# EAGLE design engine_driver (EAGLE 7.2.0)
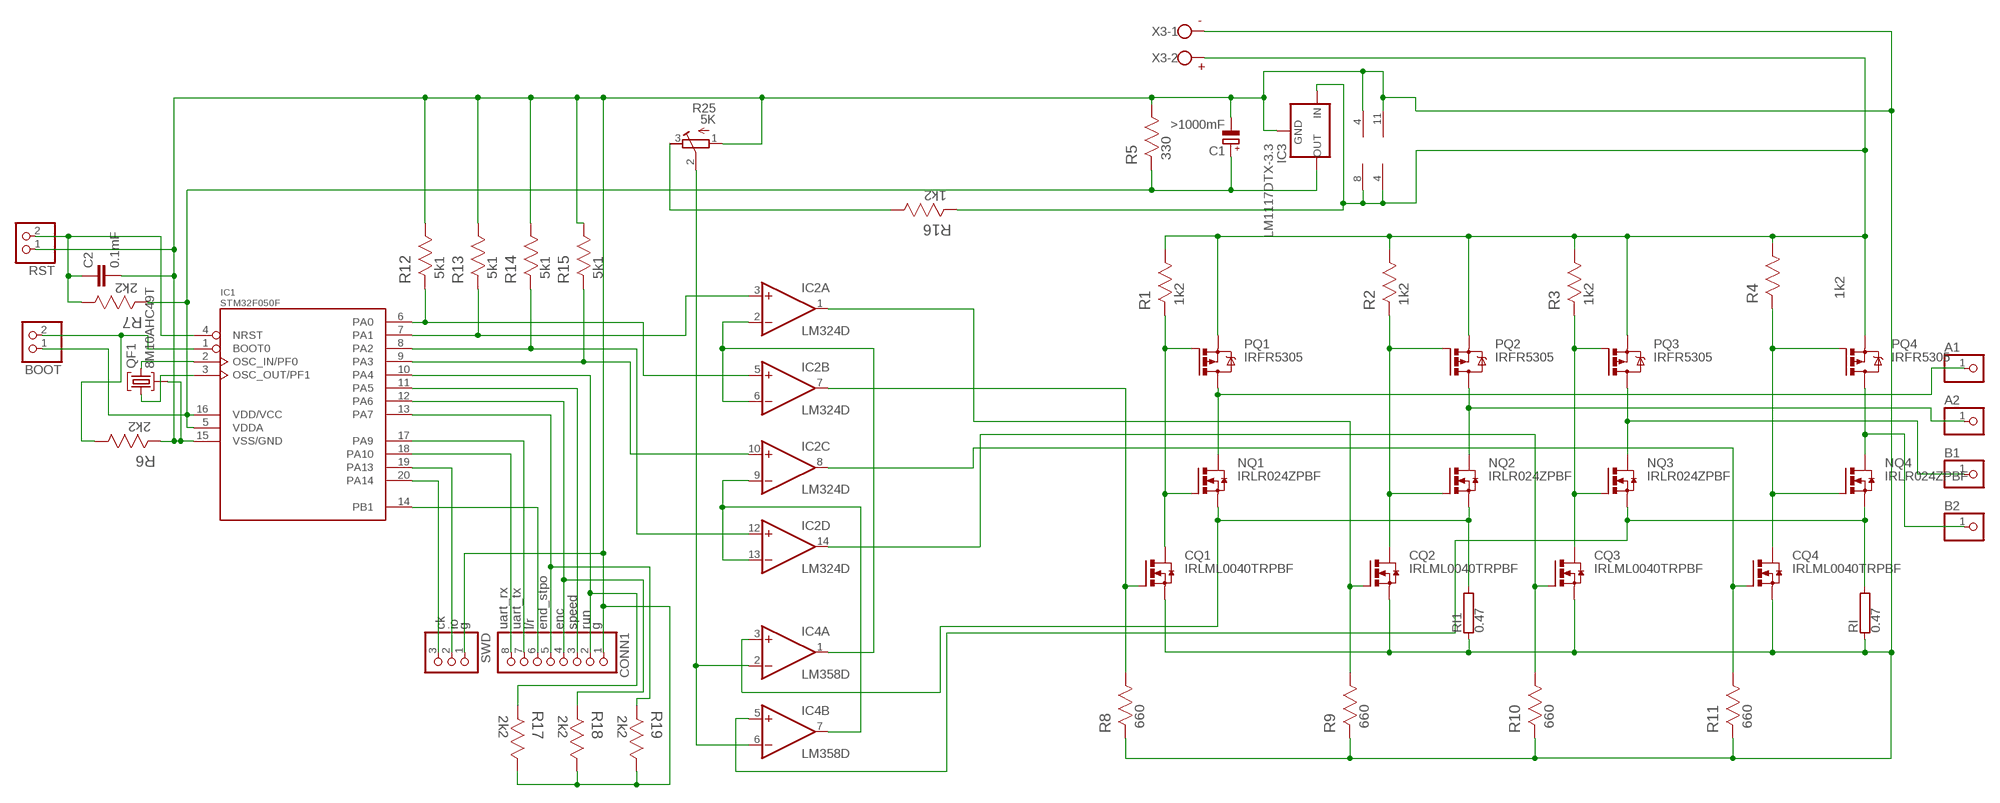
[diagram p0: schematic, sheet 1]

## Parts
A1  PINHD-1X1  [1X01]
A2  PINHD-1X1  [1X01]
B1  PINHD-1X1  [1X01]
B2  PINHD-1X1  [1X01]
BOOT  PINHD-1X2  [1X02]
C1  >1000mF  CPOL-EUE2-5  [E2-5]
C2  0.1mF  C-EUC1206  [C1206]
CONN1  PINHD-1X8  [1X08]
CQ1  IRLML0040TRPBF  [MICRO3]
CQ2  IRLML0040TRPBF  [MICRO3]
CQ3  IRLML0040TRPBF  [MICRO3]
CQ4  IRLML0040TRPBF  [MICRO3]
IC1  STM32F050F  [TSSOP20]
IC2  LM324D  [SO14]
IC3  LM1117DTX-3.3  [TO252]
IC4  LM358D  [SO08]
NQ1  IRLR024ZPBF  [D-PAK_TO252AA]
NQ2  IRLR024ZPBF  [D-PAK_TO252AA]
NQ3  IRLR024ZPBF  [D-PAK_TO252AA]
NQ4  IRLR024ZPBF  [D-PAK_TO252AA]
PQ1  IRFR5305  [D-PAK_TO252AA]
PQ2  IRFR5305  [D-PAK_TO252AA]
PQ3  IRFR5305  [D-PAK_TO252AA]
PQ4  IRFR5305  [D-PAK_TO252AA]
QF1  8M10AHC49T  [HC49U]
R1  1k2  TNPW1206100KBEEA  [RESC3216X71N]
R2  1k2  TNPW1206100KBEEA  [RESC3216X71N]
R3  1k2  TNPW1206100KBEEA  [RESC3216X71N]
R4  1k2  TNPW1206100KBEEA  [RESC3216X71N]
R5  330  TNPW1206100KBEEA  [RESC3216X71N]
R6  2k2  TNPW1206100KBEEA  [RESC3216X71N]
R7  2k2  TNPW1206100KBEEA  [RESC3216X71N]
R8  660  TNPW1206100KBEEA  [RESC3216X71N]
R9  660  TNPW1206100KBEEA  [RESC3216X71N]
R10  660  TNPW1206100KBEEA  [RESC3216X71N]
R11  660  TNPW1206100KBEEA  [RESC3216X71N]
R12  5k1  TNPW1206100KBEEA  [RESC3216X71N]
R13  5k1  TNPW1206100KBEEA  [RESC3216X71N]
R14  5k1  TNPW1206100KBEEA  [RESC3216X71N]
R15  5k1  TNPW1206100KBEEA  [RESC3216X71N]
R16  1k2  TNPW1206100KBEEA  [RESC3216X71N]
R17  2k2  TNPW1206100KBEEA  [RESC3216X71N]
R18  2k2  TNPW1206100KBEEA  [RESC3216X71N]
R19  2k2  TNPW1206100KBEEA  [RESC3216X71N]
R25  5K  R-TRIMM5W  [RTRIM5W]
RI  0.47  RHPS947  [HPS947]
RI1  0.47  RHPS947  [HPS947]
RST  PINHD-1X2  [1X02]
SWD  PINHD-1X3  [1X03]
X3  W237-102  [W237-102]

## Nets
N$1: CONN1.7 IC1.17(PA9)
N$2: IC4.3(A:+IN) NQ1.3(S) NQ2.3(S) RI1.2
N$3: IC2.2(A:-IN) IC2.6(B:-IN) IC4.1(A:OUT)
N$4: IC1.6(PA0) IC2.5(B:+IN) R12.2
N$5: IC1.7(PA1) IC2.3(A:+IN) R13.2
N$6: IC1.8(PA2) IC2.12(D:+IN) R14.2
N$7: IC1.9(PA3) IC2.10(C:+IN) R15.2
N$8: CONN1.8 IC1.18(PA10)
N$9: C1.- C2.2 CONN1.1 CQ1.2(S) CQ2.2(S) CQ3.2(S) CQ4.2(S) IC1.15(VSS/GND) IC2.11(P:V-) IC3.1(GND) IC4.4(P:V-) QF1.2 R5.1 R6.2 R8.2 R9.2 R10.2 R11.2 R12.1 R13.1 R14.1 R15.1 R17.1 R18.1 R19.1 R25.1(A) RI1.1 RI.1 RST.1 SWD.1 X3.1
N$10: CQ1.3(D) NQ1.1(G) PQ1.1(G) R1.2
N$12: CQ4.1(G) IC2.8(C:OUT) R11.1
N$13: IC4.5(B:+IN) NQ3.3(S) NQ4.3(S) RI.2
N$14: CQ3.1(G) IC2.14(D:OUT) R10.1
N$15: A1.1 NQ1.4(D) PQ1.4(D)
N$16: A2.1 NQ2.4(D) PQ2.4(D)
N$17: B2.1 NQ4.4(D) PQ4.4(D)
N$18: B1.1 NQ3.4(D) PQ3.4(D)
N$19: IC2.9(C:-IN) IC2.13(D:-IN) IC4.7(B:OUT)
N$20: IC1.20(PA14) SWD.3
N$21: R16.1 R25.3(E)
N$22: IC1.19(PA13) SWD.2
N$24: IC4.2(A:-IN) IC4.6(B:-IN) R25.2(S)
N$26: CONN1.5 IC1.13(PA7) R19.2
N$27: CONN1.4 IC1.12(PA6) R18.2
N$28: CONN1.3 IC1.11(PA5)
N$29: IC1.2(OSC_IN/PF0) QF1.3
N$30: IC1.3(OSC_OUT/PF1) QF1.1
N$31: C2.1 IC1.4(NRST) R7.1 RST.2
N$32: BOOT.2 IC1.1(BOOT0) R6.1
N$33: CONN1.2 IC1.10(PA4) R17.2
N$34: CONN1.6 IC1.14(PB1)
N$35: BOOT.1 C1.+ IC1.5(VDDA) IC1.16(VDD/VCC) IC3.TAB(OUT) R5.2 R7.2
N$36: CQ1.1(G) IC2.7(B:OUT) R8.1
N$39: IC2.4(P:V+) IC3.2(IN) IC4.8(P:V+) PQ1.3(S) PQ2.3(S) PQ3.3(S) PQ4.3(S) R1.1 R2.1 R3.1 R4.1 R16.2 X3.2
N$40: CQ2.1(G) IC2.1(A:OUT) R9.1
N$43: CQ2.3(D) NQ2.1(G) PQ2.1(G) R2.2
N$45: CQ3.3(D) NQ3.1(G) PQ3.1(G) R3.2
N$47: CQ4.3(D) NQ4.1(G) PQ4.1(G) R4.2

## Notes on the sheet
- -
- +
- ck | io | g | uart_rx | uart_tx | l/r | end_stpo | enc | speed | run | g

## Library data of the parts
A1 A2 B1 B2 = adafruit:PINHD-1X1: Pin header 1x1 for 0.1" spacing With round pins
BOOT RST = pinhead:PINHD-1X2: PIN HEADER
C1 = rcl:CPOL-EU: POLARIZED CAPACITOR, European symbol
C2 = resistor:C-EU: CAPACITOR, European symbol
CONN1 = pinhead:PINHD-1X8: PIN HEADER
CQ1-CQ4 = transistor-power:IRLML0040TRPBF: IRLML0040TRPbF NPN MOSFET 40 V 3.6 A
IC1 = STM32F050:STM32F050*: STM32F050xxF*
IC2 = linear:LM324: OP AMP
IC3 = lm1117:LM1117DTX-*
IC4 = linear:LM358: OP AMP also LM158; LM258; LM2904 Source: http://cache.national.com/ds/LM/LM158.pdf
NQ1-NQ4 = transistor-power:IRLR024ZPBF: IRLR024ZPBF, Транзистор, N-канал 55В 16А [D-PAK]
PQ1-PQ4 = transistor-power:IRF?5305: HEXFET Power MOSFET Source: http://www.irf.com/product-info/datasheets/data/irfr5305pbf.pdf
QF1 = crystal:8M10AHC49T: Monolithic Crystal Filters Source: www.vanlong.com; OC_FARNELL: unknown; OC_NEWARK: unknown
R1-R19 = Vishay_By_element14_Batch_1:TNPW1206100KBEEA: RESISTOR, 1206; MPN: TNPW1206100KBEEA; OC_FARNELL: 1862012; OC_NEWARK: 83R9020; SUPPLIER: Vishay Dale; TOLERANCE: ±0.1%; VALUE: 100K Ohms; WATTAGE: 0.25 W
R25 = rcl:R-TRIMM: Trimm resistor
RI RI1 = resistor-power:R: Power Resitor; OC_FARNELL: unknown; OC_NEWARK: unknown
SWD = adafruit:PINHD-1X3: PIN HEADER
X3 = con-wago-500:W237-102: WAGO SCREW CLAMP; MPN: 237-102; OC_FARNELL: unknown; OC_NEWARK: 70K9898

## Board
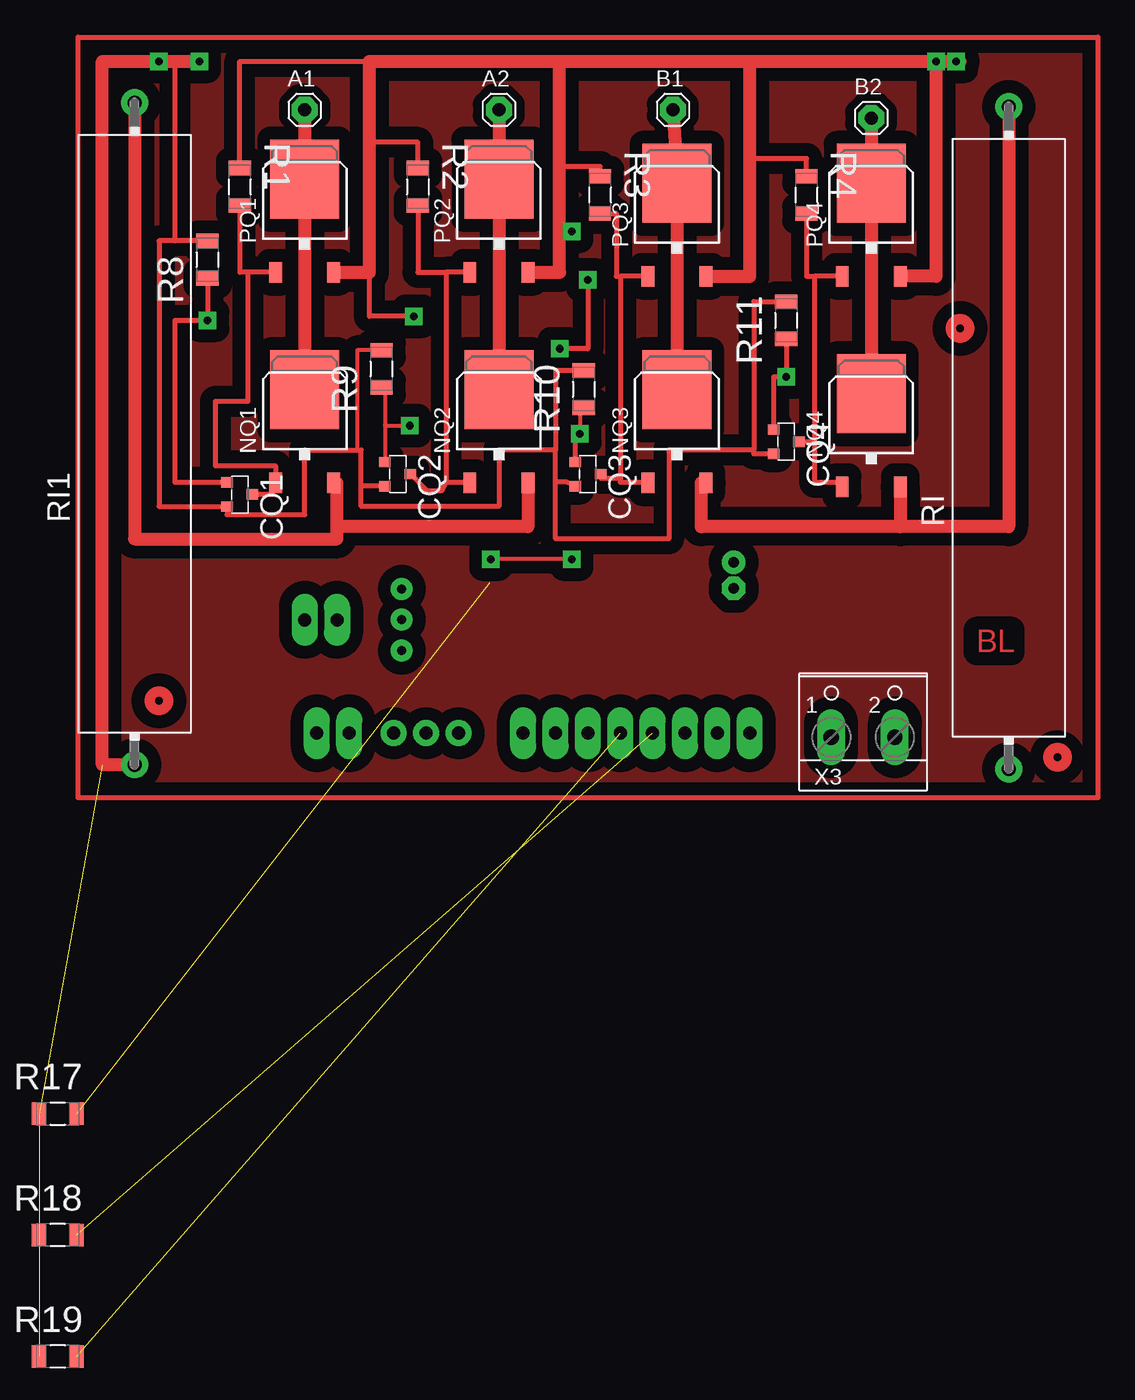
[diagram p1: board, top side]
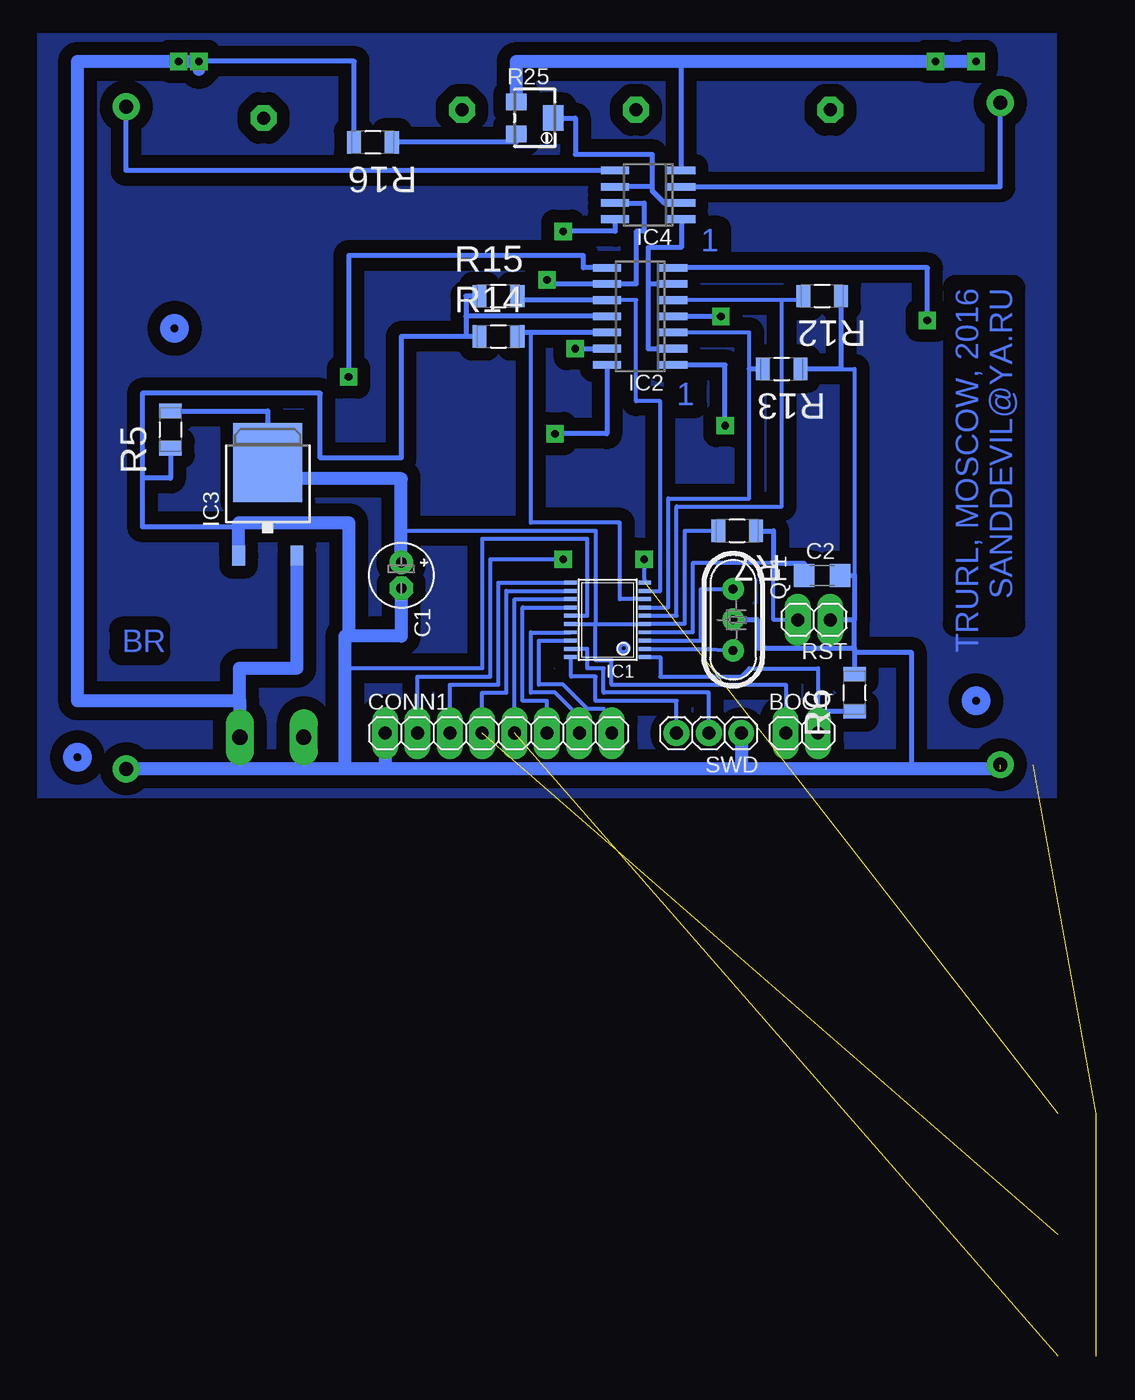
[diagram p2: board, bottom side, seen from below]

No outline drawn. Coordinates in mm, seen from the top.
Copper layers (1*16): Top 0.035mm / dielectric 1.5mm / Bottom 0.035mm
Design rules "default *": minimum track width 10mil, minimum drill 24mil, track to track 8mil, track to pad 8mil, pad to pad 8mil, via to via 8mil, smd to smd 8mil, copper to edge 40mil, drill to drill 8mil, minimum pad ring 20mil, minimum via ring 15mil, stop-mask expansion 4mil, vias tented up to drill 0mil, thermal gap 10mil

### Footprints (pad centres in the part's own frame; a part is rotated, then mirrored left to right if it is on the bottom)
1X01 = drill 1.016 pad 1.93 octagon: 1 0,0
1X02 = drill 1.016 long: 1 -1.27,0; 2 1.27,0
E2-5 = drill 0.813 pad 1.27: + -1.016,0 | drill 0.813 pad 1.27 octagon: - 1.016,0
C1206 = smd 1.6 x 1.8: 1 -1.4,0; 2 1.4,0
1X08 = drill 1.016 long: 1 -8.89,0; 2 -6.35,0; 3 -3.81,0; 4 -1.27,0; 5 1.27,0; 6 3.81,0; 7 6.35,0; 8 8.89,0
MICRO3 = smd 0.8 x 0.9: 1 -0.95,-1; 2 0.95,-1; 3 0,1
TSSOP20 = smd 0.305 x 0.991: 1 -2.925,-2.918; 2 -2.275,-2.918; 3 -1.625,-2.918; 4 -0.975,-2.918; 5 -0.325,-2.918; 6 0.325,-2.918; 7 0.975,-2.918; 8 1.625,-2.918; 9 2.275,-2.918; 10 2.925,-2.918; 11 2.925,2.918; 12 2.275,2.918; 13 1.625,2.918; 14 0.975,2.918; 15 0.325,2.918; 16 -0.325,2.918; 17 -0.975,2.918; 18 -1.625,2.918; 19 -2.275,2.918; 20 -2.925,2.918
SO14 = smd 0.6 x 2.2: 1 -3.81,-2.6; 2 -2.54,-2.6; 3 -1.27,-2.6; 4 0,-2.6; 5 1.27,-2.6; 6 2.54,-2.6; 7 3.81,-2.6; 8 3.81,2.6; 9 2.54,2.6; 10 1.27,2.6; 11 0,2.6; 12 -1.27,2.6; 13 -2.54,2.6; 14 -3.81,2.6
TO252 = smd 1 x 1.6: 1 -2.28,-4.8; 2 2.28,-4.8 | smd 5.4 x 6.2: TAB 0,2.5
SO08 = smd 0.6 x 2.2: 1 -1.905,-2.6; 2 -0.635,-2.6; 3 0.635,-2.6; 4 1.905,-2.6; 5 1.905,2.6; 6 0.635,2.6; 7 -0.635,2.6; 8 -1.905,2.6
D-PAK_TO252AA = smd 1 x 1.6: 1 -2.28,-4.8; 3 2.28,-4.8 | smd 5.4 x 6.2: 4 0,2.5
HC49U = drill 0.7 pad 1.2: 1 -2.413,0; 2 -0.027,0; 3 2.413,0
RESC3216X71N = smd 1.118 x 1.753: 1 -1.473,0; 2 1.473,0
RTRIM5W = smd 1.3 x 1.6: 1 -1.25,-1.45; 3 1.25,-1.45 | smd 2 x 1.6: 2 0,1.45
HPS947 = drill 1.1 pad 1.7: 1 -25.97,0; 2 25.97,0
1X03 = drill 1.016: 1 -2.54,0; 2 0,0; 3 2.54,0
W237-102 = drill 1.194 long: 1 -2.5,-1.27; 2 2.5,-1.27

### Placement (x,y rotation side)
A1  17.78,53.98 0 top
A2  33.02,53.98 0 top
B1  46.67,53.98 0 top
B2  62.23,53.34 0 top
BOOT  20,5.08 0 bottom
C1  51.44,17.46 270 bottom
C2  18.41,17.46 0 bottom
CONN1  43.81,5.08 0 bottom
CQ1  12.7,23.81 270 top
CQ2  25.08,25.4 270 top
CQ3  40.01,25.4 270 top
CQ4  55.56,27.94 270 top
IC1  35.24,13.97 90 bottom
IC2  32.7,37.78 90 bottom
IC3  61.91,23.81 0 bottom
IC4  32.07,47.31 90 bottom
NQ1  17.78,29.53 0 top
NQ2  33.02,29.53 0 top
NQ3  46.99,29.53 0 top
NQ4  62.23,29.21 0 top
PQ1  17.78,46.04 0 top
PQ2  33.02,46.04 0 top
PQ3  46.99,45.72 0 top
PQ4  62.23,45.72 0 top
QF1  25.4,13.97 270 bottom
R1  12.7,47.94 270 top
R2  26.67,47.94 270 top
R3  40.96,47.31 270 top
R4  57.15,47.31 270 top
R5  69.53,28.89 90 bottom
R6  15.88,8.26 90 bottom
R7  25.08,20.95 180 bottom
R8  10.16,42.23 90 top
R9  23.81,33.66 90 top
R10  39.69,32.07 90 top
R11  55.56,37.47 90 top
R12  18.41,39.37 180 bottom
R13  21.59,33.66 180 bottom
R14  43.81,36.2 0 bottom
R15  43.81,39.37 0 bottom
R16  53.66,51.44 180 bottom
R17  -1.59,-24.77 0 top
R18  -1.59,-34.29 0 top
R19  -1.59,-43.81 0 top
R25  40.96,53.34 270 bottom
RI  73.03,28.26 90 top
RI1  4.45,28.57 90 top
RST  19.05,13.97 180 bottom
SWD  27.3,5.08 180 bottom
X3  61.59,6.03 0 top

### Tracks (layer width: path | path; a pad name or v marks a point on that pad's centre or on a via)
N$1
  Bottom 0.305: IC1.17 41.27,12.99 41.27,8.26 39.37,8.26 37.47,6.35 CONN1.7
N$2
  Top 1.016: 20.32,21.27 20.32,24.73 NQ1.3 | NQ2.3 35.3,21.27 20.32,21.27 | RI1.2 4.45,20.32 20.32,20.32 20.32,21.27
  Bottom 0.406: IC4.3 4.45,47.94 RI1.2
N$3
  Bottom 0.406: IC4.1 29.47,43.18 32.07,43.18 32.07,40.32 | 32.07,40.32 32.07,35.24 IC2.2 | IC2.6 32.07,40.32
N$4
  Bottom 0.305: IC1.6 29.84,14.29 29.84,22.86 21.59,22.86 21.59,39.05 | 21.59,39.05 IC2.5 | R12.2 19.89,39.05 21.59,39.05
N$5
  Bottom 0.305: IC1.7 30.48,14.95 30.48,23.5 24.13,23.5 24.13,33.66 24.13,36.51 IC2.3
  Bottom 0.406: R13.2 24.13,33.66
N$6
  Bottom 0.305: IC1.8 34.29,15.6 34.29,21.59 41.27,21.59 41.27,36.51
  Bottom 0.406: IC2.12 41.27,36.51 42.02,36.51 R14.2
N$7
  Bottom 0.305: IC1.9 31.11,16.25 31.11,31.11 33.02,31.11 33.02,39.05 IC2.10
  Bottom 0.406: IC2.10 42.02,39.05 R15.2
N$8
  Bottom 0.305: IC1.18 40.64,12.35 40.64,8.89 38.73,8.89 36.83,6.99 35.56,6.99 34.92,6.35 CONN1.8
N$9  (via drill 0.6)  (4 unrouted)
  Top 0.305: R9.2 21.91,35.13 21.91,27.3
  Top 0.406: R10.2 37.47,33.54 37.47,27.3 | 37.47,27.3 33.02,27.3 33.02,22.86 22.23,22.86 22.23,24.45 | 22.23,24.45 22.23,27.3 21.91,27.3 17.78,27.3 17.78,22.23 11.7,22.23 CQ1.2 6.35,22.86 6.35,43.7 R8.2 7.62,43.7 7.62,57.78 | 53.02,27.3 53.02,38.94 R11.2 | 53.02,27.3 46.35,27.3 46.35,20.32 37.47,20.32 37.47,24.77 | 37.47,24.77 37.47,27.3 | CQ2.2 22.23,24.45 | CQ3.2 38.37,24.77 37.47,24.77 | CQ4.2 53.02,26.99 53.02,27.3
  Top 1.016: RI1.1 1.91,2.6 1.91,57.78 v6.35,57.78 7.62,57.78 v9.53,57.78
  Bottom 0.305: IC1.15 36.83,14.29 36.83,20.32 45.09,20.32 45.09,10.16 55.88,10.16 55.88,10.48 | R13.1 15.88,33.66 15.88,17.46
  Bottom 0.406: R5.1 69.53,25.08 71.75,25.08 | R14.1 46.35,36.2 | 46.35,36.2 51.44,36.2 51.44,26.67 57.78,26.67 57.78,31.75 71.75,31.75 71.75,25.08 | R15.1 46.35,39.37 46.35,37.78 | 46.35,37.78 46.35,36.2 | IC2.11 46.35,37.78 | R12.1 16.94,33.66 R13.1 | 15.88,11.75 15.88,13.97 | 15.88,13.97 RST.1 | C2.2 15.88,17.46 15.88,13.97 | IC4.4 29.47,57.78 29.84,57.78 | QF1.2 23.5,14 23.5,11.75 15.88,11.75 | 15.88,11.75 15.88,11.43 | 15.88,11.43 11.43,11.43 11.43,2.29 | 15.88,11.43 R6.2 | 71.75,25.08 71.75,21.27 64.19,21.27
  Bottom 1.016: 4.45,2.29 11.43,2.29 24.77,2.29 | 24.77,2.29 52.7,2.29 | 52.7,2.29 55.88,2.29 | 55.88,2.29 59.09,2.29 | X3.1 59.09,2.29 | CONN1.1 52.7,2.29 | SWD.1 24.77,2.29 | C1.- 51.44,12.7 55.56,12.7 | 55.56,12.7 55.88,12.7 55.88,10.48 55.88,2.29 | R25.1 42.41,57.78 29.84,57.78 v9.53,57.78 v6.35,57.78 | IC3.1 64.19,21.27 64.19,21.59 55.56,21.59 55.56,12.7 | 59.09,2.29 RI.1
N$10
  Top 0.406: PQ1.1 13.34,41.24 | 13.34,41.24 12.7,41.24 R1.2 | CQ1.3 15.24,23.81 15.24,24.13 15.5,24.13 NQ1.1 15.5,26.04 10.79,26.04 10.79,31.11 12.38,31.11 13.34,31.11 13.34,41.24
N$11
  Top 0.406: 0,59.69 80.01,59.69 80.01,0 0,0 0,59.69
N$12  (via drill 0.6)
  Top 0.406: R11.1 v55.56,33.02 54.56,33.02 CQ4.1
  Bottom 0.406: IC2.8 37.15,41.59 37.15,42.55 55.56,42.55 v55.56,33.02
N$13
  Top 1.016: RI.2 73.03,21.27 64.51,21.27 | 64.51,21.27 48.9,21.27 48.9,24.73 NQ3.3 | NQ4.3 64.51,21.27
  Bottom 0.406: IC4.5 73.03,49.21 RI.2
N$14  (via drill 0.6)
  Top 0.305: 39.01,30.59 39.37,30.59 v39.37,28.57
  Top 0.406: R10.1 39.01,30.59 | v39.37,28.57 39.01,27.89 CQ3.1
  Bottom 0.406: IC2.14 35.3,28.57 v39.37,28.57
N$15
  Top 1.016: NQ1.4 PQ1.4 A1.1
N$16
  Top 1.016: NQ2.4 PQ2.4 A2.1
N$17
  Top 1.016: NQ4.4 PQ4.4 B2.1
N$18
  Top 1.016: NQ3.4 PQ3.4 46.99,48.9 B1.1
N$19  (via drill 0.6)
  Top 0.406: v40.01,40.64 40.01,35.24 v37.78,35.24
  Bottom 0.406: v40.01,40.64 40.01,40.32 IC2.9 33.02,40.32 33.02,44.45 32.38,44.45 32.38,46.67 IC4.7 | v37.78,35.24 IC2.13
N$20
  Bottom 0.305: SWD.3 29.84,7.62 36.2,7.62 36.2,9.53 38.1,9.53 38.1,11.04 IC1.20
N$21
  Bottom 0.406: R25.3 42.41,51.44 R16.1
N$22
  Bottom 0.305: SWD.2 27.3,8.26 35.56,8.26 35.56,10.16 36.83,10.16 36.83,11.7 IC1.19
N$23
  pour Bottom (isolate 1.016): 0,0 80.01,0 80.01,60.01 0,60.01
N$24
  Bottom 0.406: 31.75,47.94 IC4.6 | R25.2 37.78,53.34 37.78,50.48 31.75,50.48 31.75,47.94 | 31.75,47.94 31.75,47.62 30.8,46.67 IC4.2
N$25
  pour Top (isolate 1.016): 0,0 80.01,0 80.01,59.69 0,59.69
N$26  (1 unrouted)
  Bottom 0.305: CONN1.5 42.55,15.6 IC1.13
N$27  (1 unrouted)
  Bottom 0.305: CONN1.4 45.09,8.26 43.18,8.26 43.18,16.25 IC1.12
N$28
  Bottom 0.305: CONN1.3 47.62,8.89 43.81,8.89 43.81,16.89 IC1.11
N$29
  Bottom 0.305: IC1.2 27.3,11.7 QF1.3
N$30
  Bottom 0.305: IC1.3 27.94,12.35 27.94,16.38 QF1.1
N$31
  Bottom 0.305: RST.2 22.23,13.97 22.23,18.41 28.57,18.41 28.57,12.99 IC1.4
  Bottom 0.406: R7.1 22.23,20.95 22.23,18.41 19.82,18.41 C2.1
N$32
  Bottom 0.305: IC1.1 31.11,11.04 31.11,9.53 24.77,9.53 24.13,10.16 18.73,10.16 18.73,6.99 BOOT.2
  Bottom 0.406: R6.1 18.73,6.78 18.73,6.99
N$33  (via drill 0.6)  (1 unrouted)
  Top 0.305: v38.73,18.73 v32.38,18.73
  Bottom 0.305: CONN1.2 50.16,9.53 44.45,9.53 44.45,18.73 v38.73,18.73 | v32.38,18.73 32.38,17.21 IC1.10
N$34
  Bottom 0.305: CONN1.6 40.01,7.62 41.91,7.62 41.91,14.95 IC1.14
N$35
  Bottom 0.305: IC1.16 36.2,13.64 | 51.44,20.95 36.2,20.95 36.2,13.64 | 36.2,13.64 IC1.5 29.21,13.64 29.21,20.95 R7.2 | 36.2,13.64 36.2,10.79 34.92,10.79 34.92,8.89 21.27,8.89 BOOT.1
  Bottom 0.406: R5.2 61.91,30.37 IC3.TAB
  Bottom 1.016: C1.+ 51.44,20.95 51.44,25.04 61.91,25.04 IC3.TAB
N$36  (via drill 0.6)
  Top 0.406: CQ1.1 7.62,24.76 7.62,37.47 v10.16,37.47 R8.1
  Bottom 0.406: v10.16,37.47 10.16,41.59 IC2.7
N$39  (via drill 0.6)
  Top 0.406: R1.1 12.7,57.78 23.5,57.78 | R3.1 40.96,49.53 37.78,49.53 | R4.1 57.15,50.16 52.7,50.16 | R2.1 26.67,51.44 22.86,51.44 | v26.35,37.78 22.86,37.78 22.86,41.24 | v38.73,44.45 37.78,44.45
  Top 1.016: v67.31,57.78 67.31,40.92 PQ4.3 | PQ3.3 52.7,40.92 52.7,50.16 52.7,57.78 | 52.7,57.78 v67.31,57.78 | PQ2.3 37.78,41.24 37.78,44.45 37.78,49.53 37.78,57.78 | 37.78,57.78 52.7,57.78 | PQ1.3 22.86,41.24 22.86,51.44 22.86,57.78 23.5,57.78 37.78,57.78 | v67.31,57.78 v68.9,57.78 69.22,57.78
  Bottom 0.406: IC2.4 v26.35,37.78 | R16.2 55.13,57.78 v67.31,57.78 | IC4.8 34.67,44.45 v38.73,44.45
  Bottom 1.016: X3.2 64.09,7.62 64.14,7.62 | IC3.2 59.63,10.16 64.14,10.16 64.14,7.62 | 64.14,7.62 76.83,7.62 76.83,57.78 v68.9,57.78 v67.31,57.78 67.31,57.15
N$40  (via drill 0.6)
  Top 0.305: R9.1 24.08,32.18 24.08,29.21 | 24.08,29.21 CQ2.1 | 24.08,29.21 v26.04,29.21
  Bottom 0.406: v26.04,29.21 26.04,33.97 IC2.1
N$43
  Top 0.406: PQ2.1 28.89,41.24 | 28.89,41.24 28.89,32.18 28.89,31.75 28.89,24.77 | 28.89,24.77 30.74,24.77 NQ2.1 | 28.89,24.77 28.57,24.13 27.35,24.13 CQ2.3 | R2.2 26.67,41.24 28.89,41.24
N$45
  Top 0.406: PQ3.1 42.55,40.92 | 42.55,40.92 42.55,25.08 | 42.55,25.08 42.55,24.77 43.07,24.77 44.71,24.77 NQ3.1 | R3.2 42.23,45.83 42.23,40.92 42.55,40.92 | CQ3.3 41.01,25.08 42.55,25.08
N$47
  Top 0.406: PQ4.1 57.78,40.92 | 57.78,40.92 57.78,27.94 | 57.78,27.94 57.78,24.77 59.95,24.77 NQ4.1 | R4.2 57.15,40.92 57.78,40.92 | CQ4.3 57.78,27.94
(copper drawn outside any net)
  shapes: Bottom circle x4, Top circle x3

### Text on the board
Top: BL
Bottom: 1 | TRURL, MOSCOW, 2016 / SANDDEVIL@YA.RU | 1 | BR
Document: A1 | A2 | B1 | B2 | RST | G | +12V | BOOT | G | U-RX | U-TX | GP | ENC | MOVE | RUN | G | CLK | IO | END